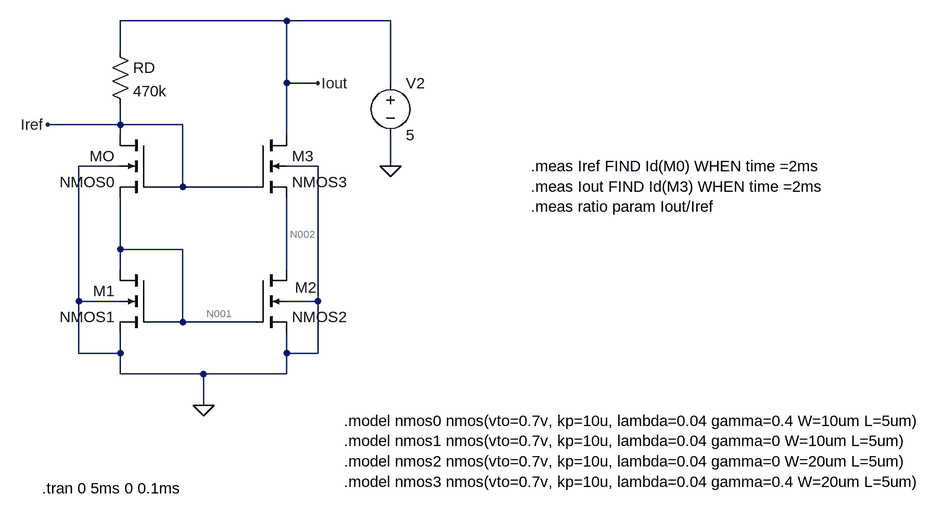
[diagram p0: schematic Current mirror.asc]
Current mirror.asc, the LTspice schematic file:
Version 4
SHEET 1 1108 680
WIRE 32 -224 -224 -224
WIRE 192 -224 32 -224
WIRE -224 -176 -224 -224
WIRE 32 -128 32 -224
WIRE 80 -128 32 -128
WIRE 192 -128 192 -224
WIRE -224 -64 -224 -96
WIRE -224 -64 -336 -64
WIRE -128 -64 -224 -64
WIRE -224 -48 -224 -64
WIRE 32 -48 32 -128
WIRE -224 0 -288 0
WIRE 80 0 32 0
WIRE 192 0 192 -48
WIRE -128 32 -128 -64
WIRE -128 32 -176 32
WIRE -16 32 -128 32
WIRE -224 128 -224 48
WIRE -128 128 -224 128
WIRE -224 160 -224 128
WIRE 32 160 32 48
WIRE -288 208 -288 0
WIRE -224 208 -288 208
WIRE 80 208 80 0
WIRE 80 208 32 208
WIRE -128 240 -128 128
WIRE -128 240 -176 240
WIRE -16 240 -128 240
WIRE -288 288 -288 208
WIRE -224 288 -224 256
WIRE -224 288 -288 288
WIRE 32 288 32 256
WIRE 80 288 80 208
WIRE 80 288 32 288
WIRE -224 320 -224 288
WIRE -96 320 -224 320
WIRE 32 320 32 288
WIRE 32 320 -96 320
WIRE -96 368 -96 320
FLAG 192 0 0
FLAG -96 368 0
FLAG 80 -128 Iout
FLAG -336 -64 Iref
DATAFLAG -224 -64 "Id(Mo)"
SYMBOL nmos4 -16 160 R0
WINDOW 0 61 27 Left 2
SYMATTR InstName M2
SYMATTR Value NMOS2
SYMBOL nmos4 -16 -48 R0
SYMATTR InstName M3
SYMATTR Value NMOS3
SYMBOL nmos4 -176 -48 M0
SYMATTR InstName MO
SYMATTR Value NMOS0
SYMBOL nmos4 -176 160 M0
SYMATTR InstName M1
SYMATTR Value NMOS1
SYMBOL res -240 -192 R0
SYMATTR InstName RD
SYMATTR Value 470k
SYMBOL voltage 192 -144 R0
WINDOW 123 0 0 Left 0
WINDOW 39 0 0 Left 0
SYMATTR InstName V2
SYMATTR Value 5
TEXT 120 392 Left 2 !.model nmos0 nmos(vto=0.7v, kp=10u, lambda=0.04 gamma=0.4 W=10um L=5um)\n.model nmos1 nmos(vto=0.7v, kp=10u, lambda=0.04 gamma=0 W=10um L=5um)\n.model nmos2 nmos(vto=0.7v, kp=10u, lambda=0.04 gamma=0 W=20um L=5um)\n.model nmos3 nmos(vto=0.7v, kp=10u, lambda=0.04 gamma=0.4 W=20um L=5um)
TEXT -344 496 Left 2 !.tran 0 5ms 0 0.1ms
TEXT 408 0 Left 2 !.meas Iref FIND Id(M0) WHEN time =2ms\n.meas Iout FIND Id(M3) WHEN time =2ms\n.meas ratio param Iout/Iref

The netlist it stands for:
* Current mirror.asc
M2 N002 N001 0 0 NMOS2
M3 Iout Iref N002 0 NMOS3
MO Iref Iref N001 0 NMOS0
M1 N001 N001 0 0 NMOS1
RD Iout Iref 470k
V2 Iout 0 5
.model NMOS NMOS
.model PMOS PMOS
.lib standard.mos
.model nmos0 nmos(vto=0.7v, kp=10u, lambda=0.04 gamma=0.4 W=10um L=5um)
.model nmos1 nmos(vto=0.7v, kp=10u, lambda=0.04 gamma=0 W=10um L=5um)
.model nmos2 nmos(vto=0.7v, kp=10u, lambda=0.04 gamma=0 W=20um L=5um)
.model nmos3 nmos(vto=0.7v, kp=10u, lambda=0.04 gamma=0.4 W=20um L=5um)
.tran 0 5ms 0 0.1ms
.meas Iref FIND Id(M0) WHEN time =2ms
.meas Iout FIND Id(M3) WHEN time =2ms
.meas ratio param Iout/Iref
.backanno
.end

* Results of the author's LTspice run, read from the files saved beside the schematic
* Operating Point, zero values left out:
*   V(n002) = 1.366 V
*   V(n001) = 1.346 V
*   V(iout) = 5 V
*   V(iref) = 2.936 V
*   Id(M2) = 8.789 µA
*   Ib(M2) = -1.376 pA
*   Is(M2) = -8.789 µA
*   Id(M3) = 8.789 µA
*   Ib(M3) = -6.386 pA
*   Is(M3) = -8.789 µA
*   Id(Mo) = 4.391 µA
*   Ib(Mo) = -4.302 pA
*   Is(Mo) = -4.391 µA
*   Id(M1) = 4.391 µA
*   Ib(M1) = -1.356 pA
*   Is(M1) = -4.391 µA
*   I(Rd) = 4.391 µA
*   I(V2) = -13.18 µA
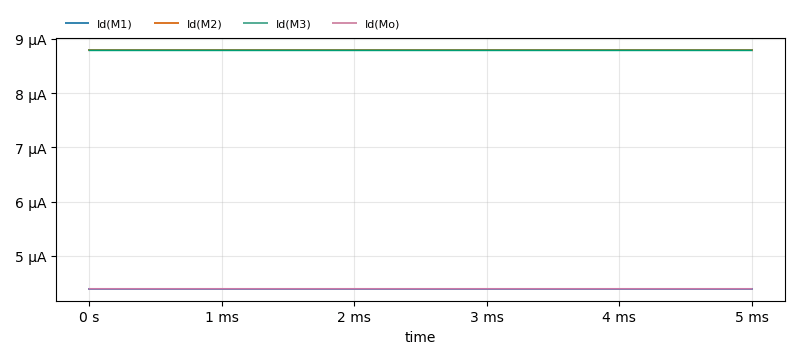
[diagram p1: Transient Analysis of Current mirror.asc, plotted from the saved traces]
* Transient Analysis, 1 run:
*   Id(M1): min 4.391 µA, max 4.391 µA, average 4.391 µA, rms 4.391 µA, last 4.391 µA
*   Id(M2): min 8.789 µA, max 8.789 µA, average 8.789 µA, rms 8.789 µA, last 8.789 µA
*   Id(M3): min 8.789 µA, max 8.789 µA, average 8.789 µA, rms 8.789 µA, last 8.789 µA
*   Id(Mo): min 4.391 µA, max 4.391 µA, average 4.391 µA, rms 4.391 µA, last 4.391 µA
* From the log:
*   Measurement "iref" FAIL'ed
*   iout: id(m3)=8.78913e-06 at 0.003
*   Measurement "ratio" FAIL'ed